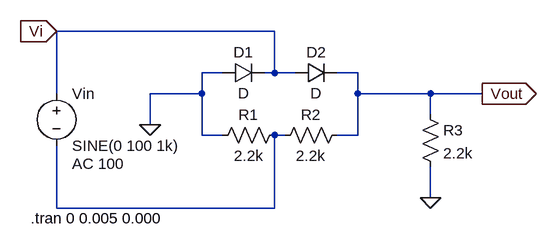
[diagram p0: schematic P-1.asc]
P-1.asc, the LTspice schematic file:
Version 4
SHEET 1 880 680
WIRE 272 32 -64 32
WIRE 192 96 160 96
WIRE 272 96 272 32
WIRE 272 96 256 96
WIRE 304 96 272 96
WIRE 400 96 368 96
WIRE -64 128 -64 32
WIRE 160 128 160 96
WIRE 160 128 80 128
WIRE 400 128 400 96
WIRE 512 128 400 128
WIRE 592 128 512 128
WIRE 512 160 512 128
WIRE 80 176 80 128
WIRE 160 192 160 128
WIRE 192 192 160 192
WIRE 288 192 272 192
WIRE 400 192 400 128
WIRE 400 192 368 192
WIRE 512 288 512 240
WIRE -64 304 -64 208
WIRE 272 304 272 192
WIRE 272 304 -64 304
FLAG 80 176 0
FLAG 512 288 0
FLAG -64 32 Vi
IOPIN -64 32 In
FLAG 592 128 Vout
IOPIN 592 128 Out
SYMBOL voltage -64 112 R0
WINDOW 123 24 124 Left 2
WINDOW 39 0 0 Left 0
SYMATTR Value2 AC 100
SYMATTR InstName Vin
SYMATTR Value SINE(0 100 1k)
SYMBOL diode 192 112 R270
WINDOW 0 32 32 VTop 2
WINDOW 3 0 32 VBottom 2
SYMATTR InstName D1
SYMBOL diode 304 112 R270
WINDOW 0 32 32 VTop 2
WINDOW 3 0 32 VBottom 2
SYMATTR InstName D2
SYMBOL res 288 176 R90
WINDOW 0 0 56 VBottom 2
WINDOW 3 32 56 VTop 2
SYMATTR InstName R1
SYMATTR Value 2.2k
SYMBOL res 384 176 R90
WINDOW 0 0 56 VBottom 2
WINDOW 3 32 56 VTop 2
SYMATTR InstName R2
SYMATTR Value 2.2k
SYMBOL res 496 144 R0
SYMATTR InstName R3
SYMATTR Value 2.2k
TEXT -104 320 Left 2 !.tran 0 0.005 0.000

The netlist it stands for:
* P-1.asc
Vin Vi N001 SINE(0 100 1k) AC 100
D1 0 Vi D
D2 Vi Vout D
R1 N001 0 2.2k
R2 Vout N001 2.2k
R3 Vout 0 2.2k
.model D D
.lib standard.dio
.tran 0 0.005 0.000
.backanno
.end

* Results of the author's LTspice run, read from the files saved beside the schematic
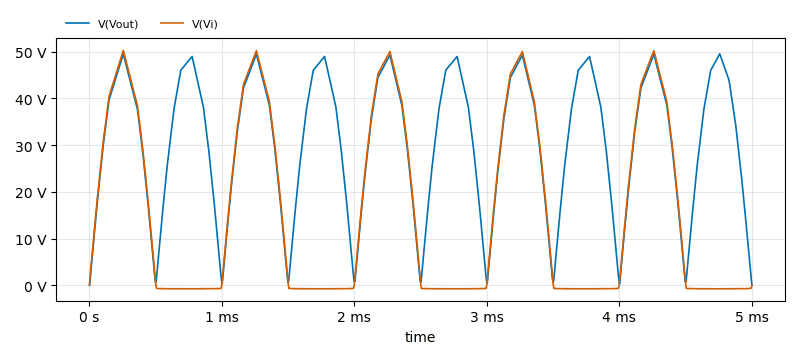
[diagram p1: Transient Analysis of P-1.asc, plotted from the saved traces]
* Transient Analysis, 1 run:
*   V(Vout): min 0 V, max 49.54 V, average 30.9 V, rms 34.5 V, last 0 V
*   V(Vi): min -764.1 mV, max 50.28 V, average 15.4 V, rms 24.8 V, last 0 V